# Altium project Science.PrjPcb
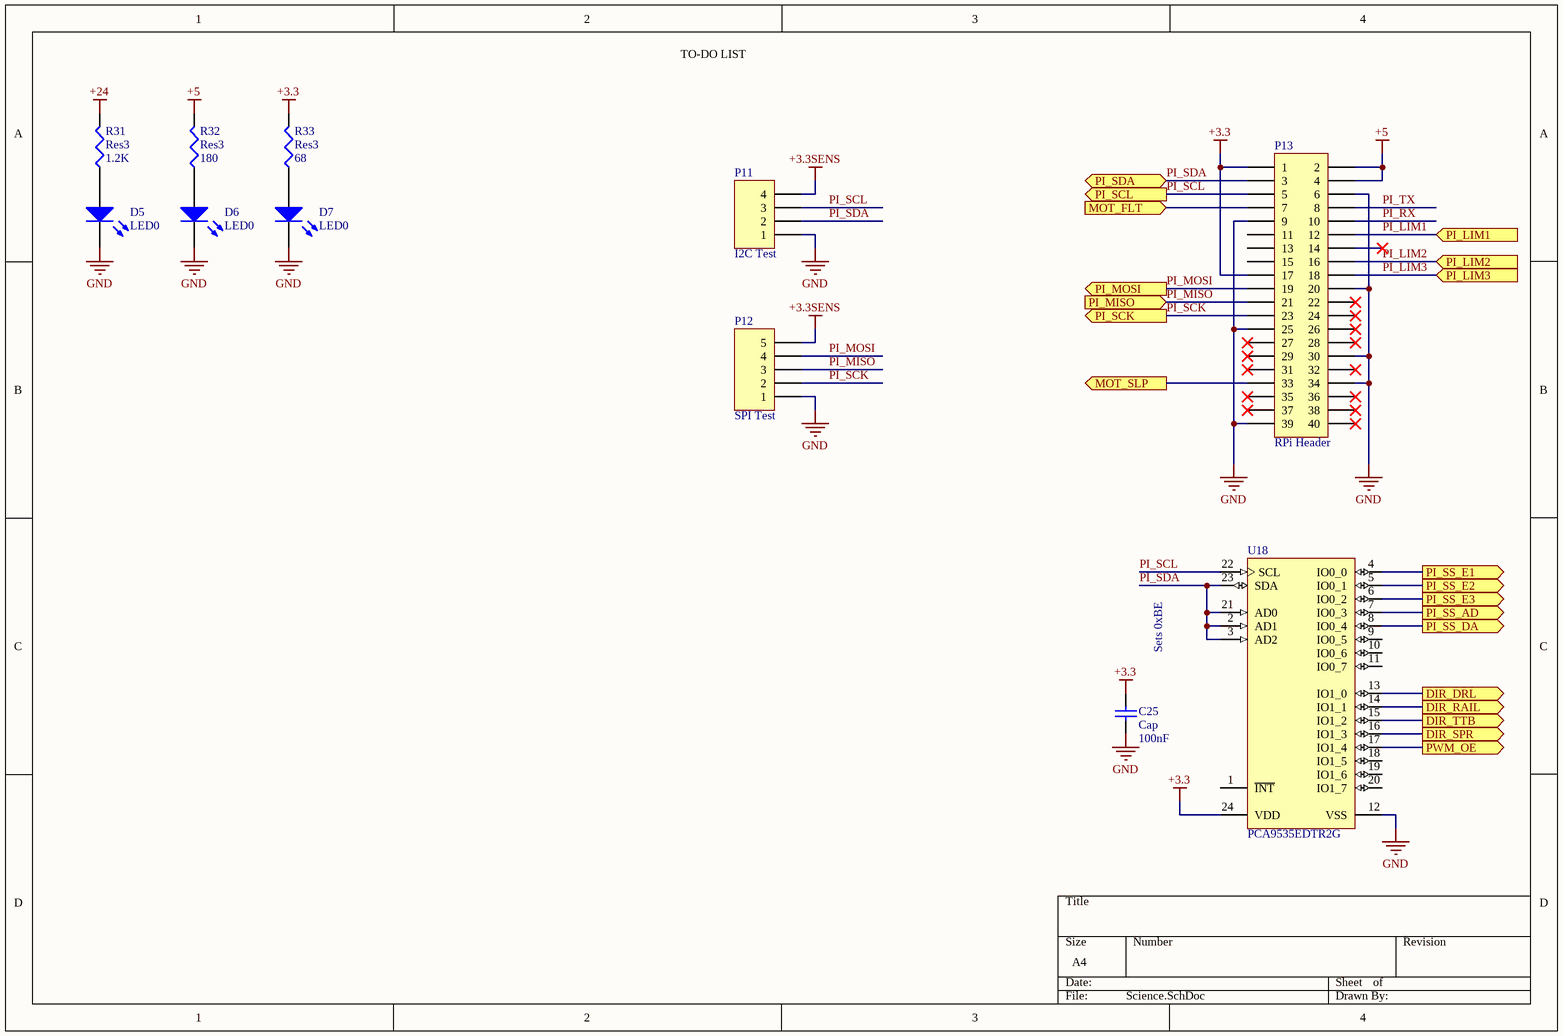
[diagram p0: Science.SchDoc]
6 sheets, 133 parts. Net scope: flat (ports and power ports of the same name join across sheets).
Board file: Science.PcbDoc
Sheets:
  Science.SchDoc
  Power.SchDoc
  SensorExt.SchDoc
  SensorInt.SchDoc
  Motors.SchDoc
  Drivers.SchDoc

## Sheet Science.SchDoc
size A4

### Parts
C25  Cap  value 100nF  [C0805]
D5  LED0  [1608[0603]]
D6  LED0  [1608[0603]]
D7  LED0  [1608[0603]]
P11  I2C Test  [HDR1X4]
P12  SPI Test  [HDR1X5]
P13  RPi Header  [RPi-3B+]
R31  Res3  value 1.2K  [C0805]
R32  Res3  value 180  [C0805]
R33  Res3  value 68  [C0805]
U18  PCA9535EDTR2G  [ONSC-TSSOP-24-948H_V]

### Ports
DIR_DRL (out), DIR_RAIL (out), DIR_SPR (out), DIR_TTB (out), MOT_FLT (in), MOT_SLP (out), PI_LIM1 (in), PI_LIM2 (in), PI_LIM3 (in), PI_MISO (in), PI_MOSI (out), PI_SCK (out), PI_SCL (out), PI_SDA (bidir), PI_SS_AD (out), PI_SS_DA (out), PI_SS_E1 (out), PI_SS_E2 (out), PI_SS_E3 (out), PWM_OE (out)

### Nets
+3.3: C25.2 P13.1 P13.17 R33.2 U18.24(VDD)
+3.3SENS: P11.4 P12.5
+5: P13.2 P13.4 R32.2
+24: R31.2
GND: C25.1 D5.2(K) D6.2(K) D7.2(K) P11.1 P12.1 P13.6 P13.9 P13.20 P13.25 P13.30 P13.34 P13.39 U18.12(VSS)
FAULT: P13.7 ; port MOT_FLT
PI_LIM1: P13.12 ; port PI_LIM1
PI_LIM2: P13.16 ; port PI_LIM2
PI_LIM3: P13.18 ; port PI_LIM3
PI_MISO: P12.3 P13.21 ; port PI_MISO
PI_MOSI: P12.4 P13.19 ; port PI_MOSI
PI_RX: P13.10
PI_SCK: P12.2 P13.23 ; port PI_SCK
PI_SCL: P11.3 P13.5 U18.22(SCL) ; port PI_SCL
PI_SDA: P11.2 P13.3 U18.2(AD1) U18.3(AD2) U18.21(AD0) U18.23(SDA) ; port PI_SDA
PI_TX: P13.8
SLEEP: P13.33 ; port MOT_SLP
NetD5_1: D5.1(A) R31.1
NetD6_1: D6.1(A) R32.1
NetD7_1: D7.1(A) R33.1
NetR1_2: U18.17(IO1_4) ; port PWM_OE
NetU6_11: U18.8(IO0_4) ; port PI_SS_DA
NetU7_2: U18.13(IO1_0) ; port DIR_DRL
NetU8_2: U18.14(IO1_1) ; port DIR_RAIL
NetU9_2: U18.15(IO1_2) ; port DIR_TTB
NetU10_2: U18.16(IO1_3) ; port DIR_SPR
NetU18_4: U18.4(IO0_0) ; port PI_SS_E1
NetU18_5: U18.5(IO0_1) ; port PI_SS_E2
NetU18_6: U18.6(IO0_2) ; port PI_SS_E3
NetU18_7: U18.7(IO0_3) ; port PI_SS_AD

Not connected (* = marked no-connect by the designer): P13 11 13 14* 15 22* 24* 26* 27* 28* 29* 31* 32* 35* 36* 37* 38* 40*; U18 1(~{INT}) 9(IO0_5) 10(IO0_6) 11(IO0_7) 18(IO1_5) 19(IO1_6) 20(IO1_7)

### Notes on the sheet
- TO-DO LIST
- Sets 0xBE

### Library data of the parts
C25 = Cap: Capacitor; Published: 8-Jun-2000; LatestRevisionDate: 17-Jul-2002; LatestRevisionNote: Re-released for DXP Platform.; PackageReference: RAD-0.3; Publisher: Altium Limited; PackageDescription: Radial Cap, Thru-Hole; 2 Leads; 0.3 in Pin Spacing
D5-D7 = LED0: Typical INFRARED GaAs LED; Published: 8-Jun-2000; LatestRevisionDate: 08-Jul-2005; LatestRevisionNote: Mech Layer 1 removed.; PackageReference: LED-0; Publisher: Altium Limited; PackageDescription: LED; 2 Leads
P11 = Header 4: Header, 4-Pin; LatestRevisionDate: 17-Jul-2002; LatestRevisionNote: Re-released for DXP Platform.; Publisher: Altium Limited
P12 = Header 5: Header, 5-Pin; LatestRevisionDate: 17-Jul-2002; LatestRevisionNote: Re-released for DXP Platform.; Publisher: Altium Limited
P13 = Header 20X2: Header, 20-Pin, Dual row; LatestRevisionDate: 17-Jul-2002; LatestRevisionNote: Re-released for DXP Platform.; Publisher: Altium Limited
R31-R33 = Res3: Resistor; Published: 8-Jun-2000; LatestRevisionDate: 29-May-2009; LatestRevisionNote: IPC-7351 Footprint Added.; PackageReference: J1-0603; Publisher: Altium Limited; PackageDescription: Chip Resistor
U18 = CMP-1316-00043-1: 16-Bit Low-Power I/O Expander for I2C Bus with Interrupt, 1.65 to 5.5 V, -55 to 125 degC, 24-Pin TSSOP, Pb-Free, Tape and Reel; Manufacturer: On Semiconductor; VCC Min (V): 1.65; LED Blink/PWM: No; I/O: 16; VCC Max (V): 5.5; RoHS: TRUE; DatasheetVersion: Rev. 5; ComponentLink3Description: Package Specification; PackageVersion: Rev. B, 06/2012; ComponentLink3URL: http://www.onsemi.cn/pub_link/Collateral/948H-01.PDF; Mounting Technology: Surface Mount; ComponentLink2URL: http://www.onsemi.com/pub_link/Collateral/PCA9535E-D.PDF; PartNumber: PCA9535EDTR2G; ComponentLink1Description: Manufacturer URL; ComponentLink1URL: http://www.onsemi.com/; PackageReference: TSSOP-24-948H; ComponentLink2Description: Datasheet; PackageDescription: 24-Pin Small Outline Package, Body 7.8 x 4.4 mm, Pitch 0.65 mm; Packing: Tape and Reel

## Sheet Power.SchDoc
size A4
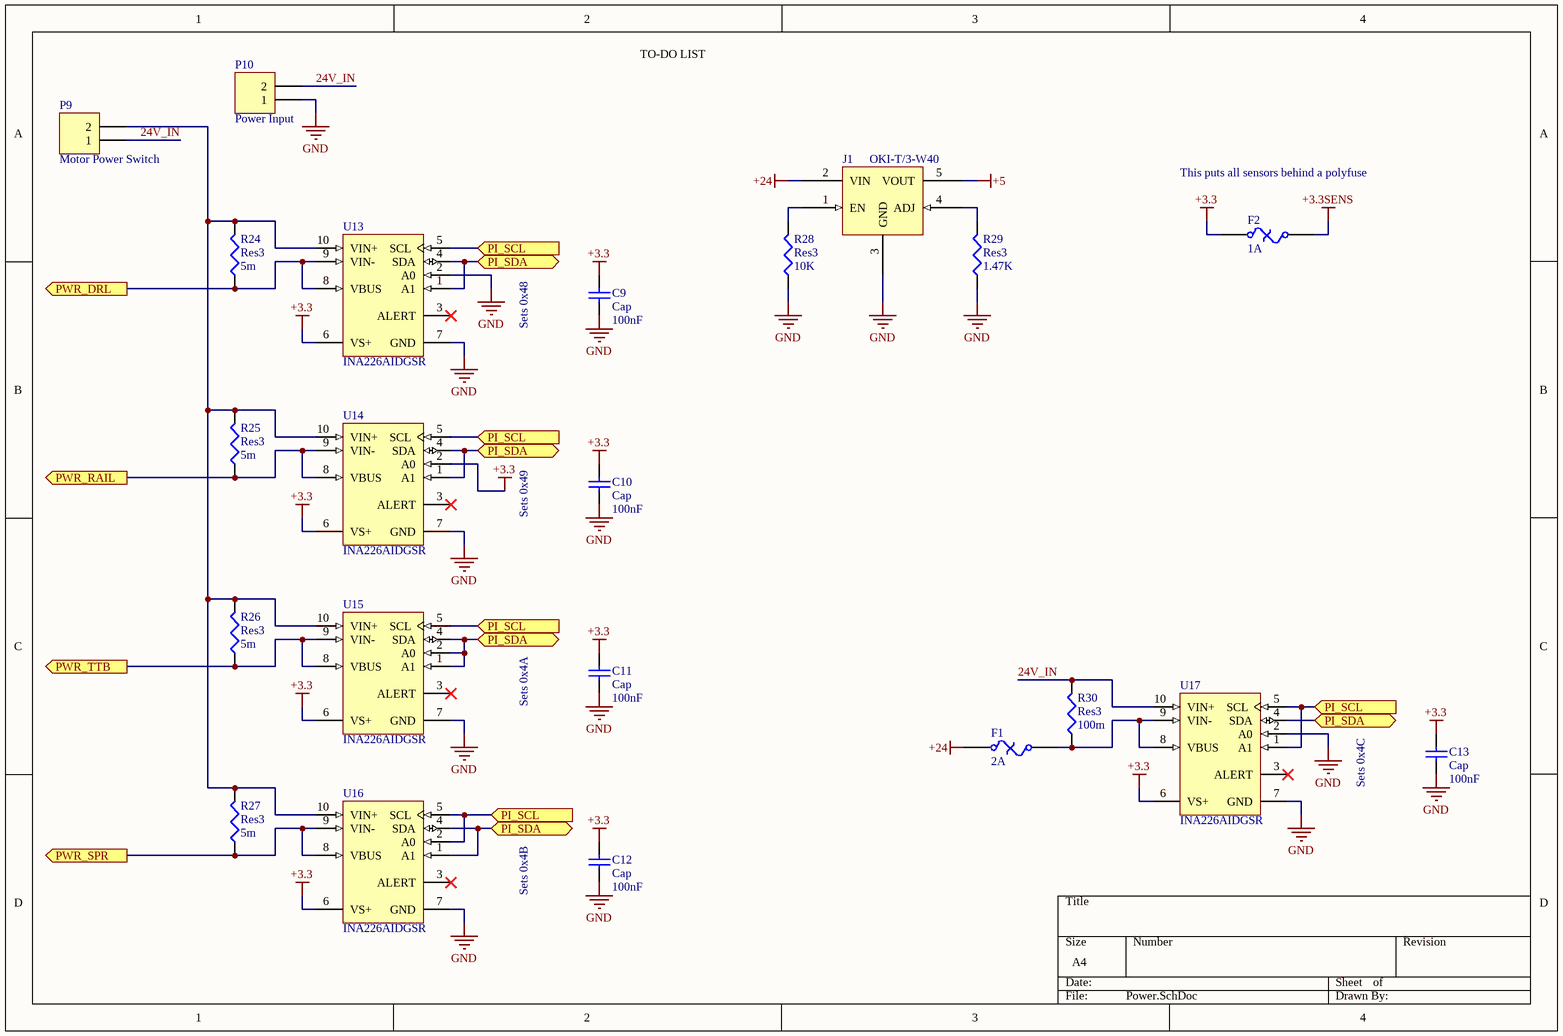
[diagram p1: Power.SchDoc]

### Parts
C9  Cap  value 100nF  [C0805]
C10  Cap  value 100nF  [C0805]
C11  Cap  value 100nF  [C0805]
C12  Cap  value 100nF  [C0805]
C13  Cap  value 100nF  [C0805]
F1  2A  [2920]
F2  1A  [2920]
J1  OKI-T/3-W40  [OKI-T/3-W40]
P9  Motor Power Switch  [SuperSabre-2pos]
P10  Power Input  [SuperSabre-2pos]
R24  Res3  value 5m  [FCSL110]
R25  Res3  value 5m  [FCSL110]
R26  Res3  value 5m  [FCSL110]
R27  Res3  value 5m  [FCSL110]
R28  Res3  value 10K  [C0805]
R29  Res3  value 1.47K  [C0805]
R30  Res3  value 100m  [RW5S0]
U13  INA226AIDGSR  [DGS0010A_L]
U14  INA226AIDGSR  [DGS0010A_L]
U15  INA226AIDGSR  [DGS0010A_L]
U16  INA226AIDGSR  [DGS0010A_L]
U17  INA226AIDGSR  [DGS0010A_L]

### Ports
PI_SCL (in), PI_SDA (bidir), PWR_DRL (out), PWR_RAIL (out), PWR_SPR (out), PWR_TTB (out)

### Nets
+3.3: C9.2 C10.2 C11.2 C12.2 C13.2 F2.1 U13.6(VS+) U14.2(A0) U14.6(VS+) U15.6(VS+) U16.6(VS+) U17.6(VS+)
+3.3SENS: F2.2
+5: J1.5(VOUT)
+24: F1.1 J1.2(VIN)
GND: C9.1 C10.1 C11.1 C12.1 C13.1 J1.3(GND) P10.1 R28.1 R29.1 U13.2(A0) U13.7(GND) U14.7(GND) U15.7(GND) U16.7(GND) U17.2(A0) U17.7(GND)
24V_IN: P9.1 P10.2 R30.2 U17.10(VIN+)
PI_SCL: U13.5(SCL) U14.5(SCL) U15.5(SCL) U16.2(A0) U16.5(SCL) U17.1(A1) U17.5(SCL) ; port PI_SCL
PI_SDA: U13.1(A1) U13.4(SDA) U14.1(A1) U14.4(SDA) U15.1(A1) U15.2(A0) U15.4(SDA) U16.1(A1) U16.4(SDA) U17.4(SDA) ; port PI_SDA
NetF1_2: F1.2 R30.1 U17.8(VBUS) U17.9(VIN-)
NetJ1_1: J1.1(EN) R28.2
NetJ1_4: J1.4(ADJ) R29.2
NetP9_2: P9.2 R24.2 R25.2 R26.2 R27.2 U13.10(VIN+) U14.10(VIN+) U15.10(VIN+) U16.10(VIN+)
NetR24_1: R24.1 U13.8(VBUS) U13.9(VIN-) ; port PWR_DRL
NetR25_1: R25.1 U14.8(VBUS) U14.9(VIN-) ; port PWR_RAIL
NetR26_1: R26.1 U15.8(VBUS) U15.9(VIN-) ; port PWR_TTB
NetR27_1: R27.1 U16.8(VBUS) U16.9(VIN-) ; port PWR_SPR

Not connected (* = marked no-connect by the designer): U13 3(ALERT)*; U14 3(ALERT)*; U15 3(ALERT)*; U16 3(ALERT)*; U17 3(ALERT)*

### Notes on the sheet
- (near J1) TO-DO LIST
- This puts all sensors behind a polyfuse
- Sets 0x48
- Sets 0x49
- Sets 0x4A
- Sets 0x4C
- Sets 0x4B

### Library data of the parts
C9-C13 = Cap: Capacitor; Published: 8-Jun-2000; LatestRevisionDate: 17-Jul-2002; LatestRevisionNote: Re-released for DXP Platform.; PackageReference: RAD-0.3; Publisher: Altium Limited; PackageDescription: Radial Cap, Thru-Hole; 2 Leads; 0.3 in Pin Spacing
F1 F2 = Fuse Thermal: Thermal Fuse; Published: 24-Mar-1999; LatestRevisionDate: 17-Jul-2002; LatestRevisionNote: Re-released for DXP Platform.; PackageReference: PIN-W2/E2.8; Publisher: Altium Limited; PackageDescription: Thru-Hole; 2 Leads
J1 = OKI-T/3-W40: Adjustable Output 3-Amp DOSA-SMT DC/DC Converters; ComponentLink1Description: Datasheet; ComponentLink1URL: https://power.murata.com/data/power/oki-t3-w40.pdf
P9 P10 = Header 2: Header, 2-Pin; LatestRevisionDate: 17-Jul-2002; LatestRevisionNote: Re-released for DXP Platform.; Publisher: Altium Limited
R24-R30 = Res3: Resistor; Published: 8-Jun-2000; LatestRevisionDate: 29-May-2009; LatestRevisionNote: IPC-7351 Footprint Added.; PackageReference: J1-0603; Publisher: Altium Limited; PackageDescription: Chip Resistor
U13-U17 = CMP-0704-00058-2: High-Side Measurement, Bi-Directional Current / Power Monitor with I2C Interface, 2.7 to 5.5 V, -40 to 125 degC, 10-pin SOP (DGS10), Green (RoHS & no Sb/Br); Vs(Max)(V): 5.5; CMRR(Min)(dB): 126; Rating: Catalog; Input Offset (+/-)(Max)(uV): 10; Small-Signal Bandwidth(Typ)(MHz): 0.007; Input Offset Drift (+/-)(Max)(uV/Degrees Celsius): 0.1; Common Mode Range(Max)(V): 36; Gain(V/V): 1; SubFamily: Current Shunt Monitor; Quiescent Current (+/-)(Typ)(mA): 0.33; Vs(Min)(V): 2.7; Common Mode Range(Min)(V): 0; ComponentLink2URL: http://www.ti.com/general/docs/lit/getliterature.tsp?genericPartNumber=INA226&fileType=pdf; ComponentLink1URL: http://www.ti.com/; PartNumber: INA226AIDGSR; Mounting Technology: Surface Mount; PackageDescription: 10-Pin Plastic Small Outline, Body 3 x 3 mm, Pitch 0.5 mm; ComponentLink3Description: Package Specification; Code_JEDEC: MO-153; Eco-Plan: Green (RoHS & no Sb/Br); PackageReference: DGS0010A; ComponentLink2Description: Datasheet; ComponentLink3URL: http://www.ti.com/lit/ml/mpds035b/mpds035b.pdf; ComponentLink1Description: Manufacturer URL; DatasheetVersion: SBOS547; PackageVersion: 4073272/C, 02/2004

## Sheet SensorExt.SchDoc
size A4
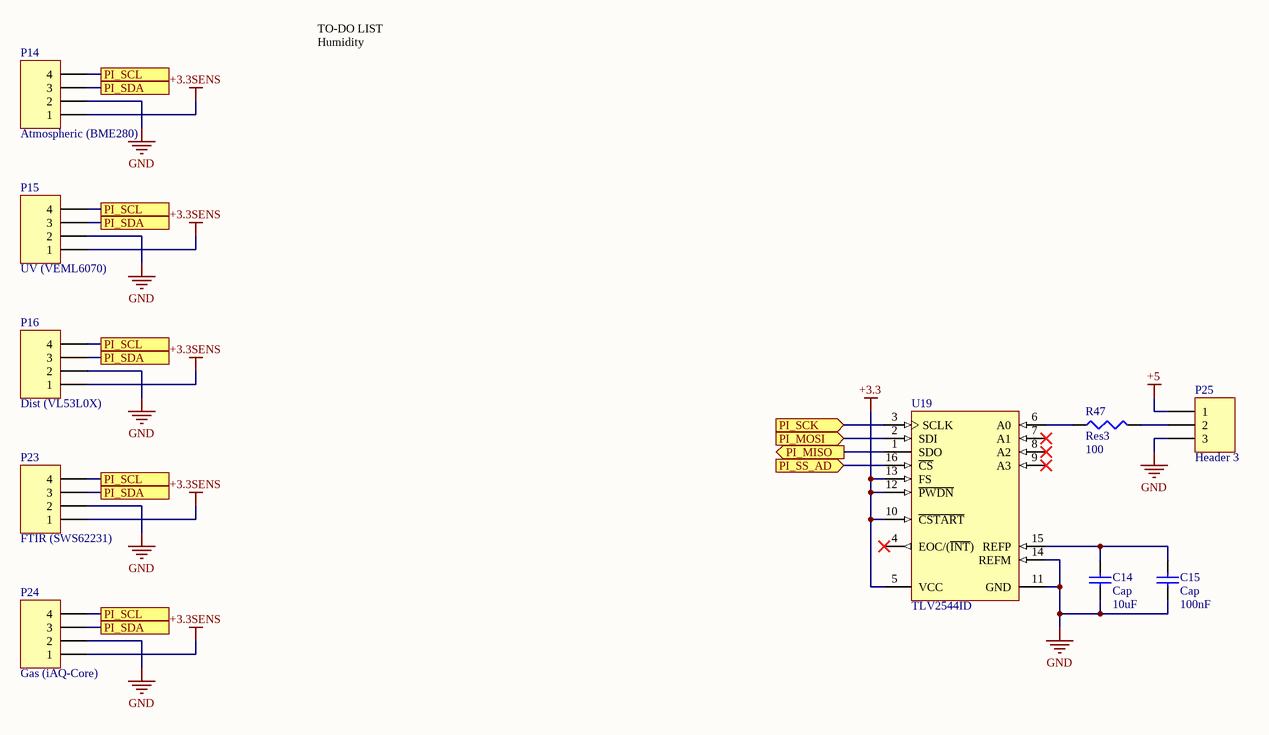
[diagram p2: SensorExt.SchDoc]

### Parts
C14  Cap  value 10uF  [C0805]
C15  Cap  value 100nF  [C0805]
P14  Atmospheric (BME280)  [22-23-20x1-4pos]
P15  UV (VEML6070)  [22-23-20x1-4pos]
P16  Dist (VL53L0X)  [22-23-20x1-4pos]
P23  FTIR (SWS62231)  [22-23-20x1-4pos]
P24  Gas (iAQ-Core)  [22-23-20x1-4pos]
P25  Header 3  [22-23-20x1-3pos]
R47  Res3  value 100  [C0805]
U19  TLV2544ID  [TI-D16_M]

### Ports
PI_MISO (out), PI_MOSI (in), PI_SCK (in), PI_SCL, PI_SDA, PI_SS_AD (in)

### Nets
+3.3: U19.5(VCC) U19.10(~{CSTART}) U19.12(~{PWDN}) U19.13(FS)
+3.3SENS: P14.1 P15.1 P16.1 P23.1 P24.1
+5: P25.1
GND: C14.1 C15.1 P14.2 P15.2 P16.2 P23.2 P24.2 P25.3 U19.11(GND) U19.14(REFM)
PI_MISO: U19.1(SDO) ; port PI_MISO
PI_MOSI: U19.2(SDI) ; port PI_MOSI
PI_SCK: U19.3(SCLK) ; port PI_SCK
PI_SCL: P14.4 P15.4 P16.4 P23.4 P24.4 ; port PI_SCL
PI_SDA: P14.3 P15.3 P16.3 P23.3 P24.3 ; port PI_SDA
NetC14_2: C14.2 C15.2 U19.15(REFP)
NetP25_2: P25.2 R47.2
NetR47_1: R47.1 U19.6(A0)
NetU18_7: U19.16(~{CS}) ; port PI_SS_AD

Not connected (* = marked no-connect by the designer): U19 4(EOC/(~{INT}))* 7(A1)* 8(A2)* 9(A3)*

### Notes on the sheet
- TO-DO LIST
  Humidity

### Library data of the parts
C14 C15 = Cap: Capacitor; Published: 8-Jun-2000; LatestRevisionDate: 17-Jul-2002; LatestRevisionNote: Re-released for DXP Platform.; PackageReference: RAD-0.3; Publisher: Altium Limited; PackageDescription: Radial Cap, Thru-Hole; 2 Leads; 0.3 in Pin Spacing
P14-P16 P23 P24 = Header 4: Header, 4-Pin; LatestRevisionDate: 17-Jul-2002; LatestRevisionNote: Re-released for DXP Platform.; Publisher: Altium Limited
P25 = Header 3: Header, 3-Pin; LatestRevisionDate: 17-Jul-2002; LatestRevisionNote: Re-released for DXP Platform.; Publisher: Altium Limited
R47 = Res3: Resistor; Published: 8-Jun-2000; LatestRevisionDate: 29-May-2009; LatestRevisionNote: IPC-7351 Footprint Added.; PackageReference: J1-0603; Publisher: Altium Limited; PackageDescription: Chip Resistor
U19 = CMP-0003-01025-2: 12-Bit 200 kSPS ADC Serial Out, Auto Power Down (Software and Hardware), Low Power with 8 x FIFO with 4 Channel, -40 to 85 degC, 16-pin SOIC (D16), Green (RoHS & no Sb/Br); Manufacturer: Texas Instruments; SFDR(dB): 84; Architecture: SAR; Digital Supply(Min)(V): 2.7; Interface: Serial SPI; ENOB(Bits): 11.6; # Input Channels: 4; Sample Rate (max)(SPS): 200k; Analog Voltage AV/DD(Max)(V): 5.5; SubFamily: Precision ADC (<=10MSPS); INL(Max)(+/-LSB): 1; SINAD(dB): 70; Resolution(Bits): 12; DatasheetVersion: SLAS198E; Analog Voltage AV/DD(Min)(V): 2.7; PackageDescription: 16-Pin Plastic Small Outline, Body 9.9 x 3.9 mm, Pitch 1.27 mm; PackageVersion: 4040047-6/M, 06/2011; PartNumber: TLV2544ID; Eco-Plan: Green (RoHS & no Sb/Br); ComponentLink2Description: Datasheet; PackageReference: D16; ComponentLink3Description: Package Specification; Code_JEDEC: MS-012; ComponentLink3URL: http://www.ti.com/litv/pdf/mpds178g; Digital Supply(Max)(V): 5.5; ComponentLink1Description: Manufacturer URL; Mounting Technology: Surface Mount; ComponentLink2URL: http://www.ti.com/general/docs/lit/getliterature.tsp?genericPartNumber=TLV2544&fileType=pdf; ComponentLink1URL: http://www.ti.com/

## Sheet SensorInt.SchDoc
size A4
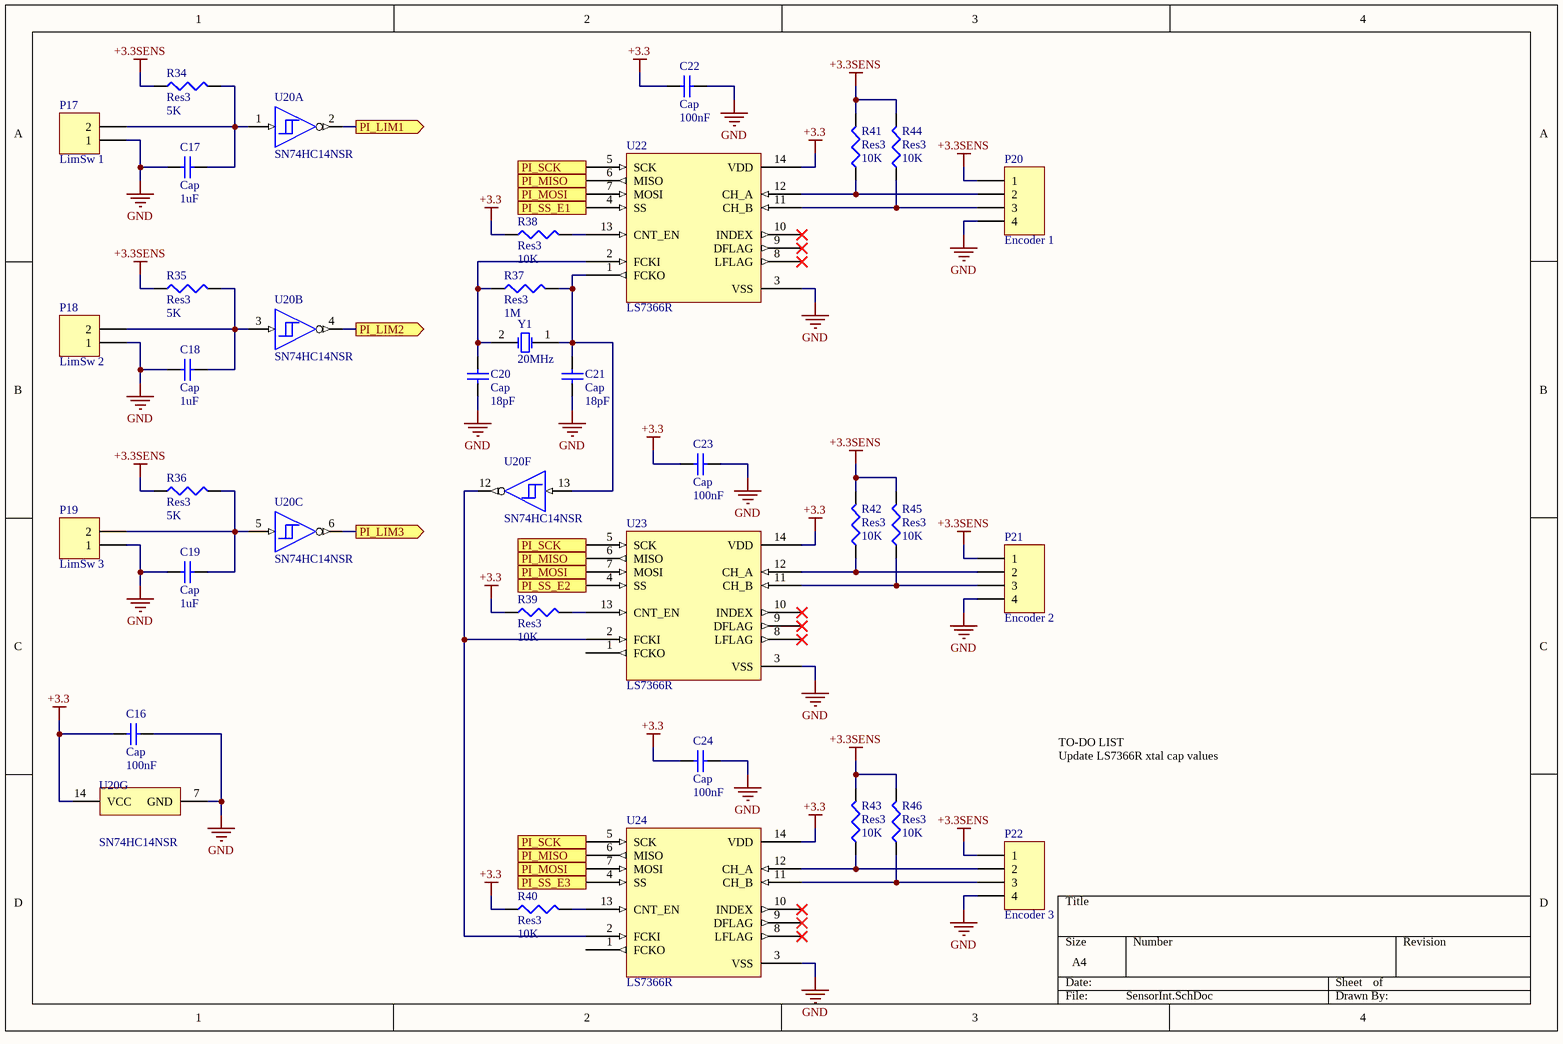
[diagram p3: SensorInt.SchDoc]

### Parts
C16  Cap  value 100nF  [C0805]
C17  Cap  value 1uF  [C0805]
C18  Cap  value 1uF  [C0805]
C19  Cap  value 1uF  [C0805]
C20  Cap  value 18pF  [C0805]
C21  Cap  value 18pF  [C0805]
C22  Cap  value 100nF  [C0805]
C23  Cap  value 100nF  [C0805]
C24  Cap  value 100nF  [C0805]
P17  LimSw 1  [22-23-20x1-2pos]
P18  LimSw 2  [22-23-20x1-2pos]
P19  LimSw 3  [22-23-20x1-2pos]
P20  Encoder 1  [22-23-20x1-4pos]
P21  Encoder 2  [22-23-20x1-4pos]
P22  Encoder 3  [22-23-20x1-4pos]
R34  Res3  value 5K  [C0805]
R35  Res3  value 5K  [C0805]
R36  Res3  value 5K  [C0805]
R37  Res3  value 1M  [C0805]
R38  Res3  value 10K  [C0805]
R39  Res3  value 10K  [C0805]
R40  Res3  value 10K  [C0805]
R41  Res3  value 10K  [C0805]
R42  Res3  value 10K  [C0805]
R43  Res3  value 10K  [C0805]
R44  Res3  value 10K  [C0805]
R45  Res3  value 10K  [C0805]
R46  Res3  value 10K  [C0805]
U20  SN74HC14NSR  [NS0014A_M]  (parts A,B,C,F,G of 7)
U22  LS7366R  [SOIC14N]
U23  LS7366R  [SOIC14N]
U24  LS7366R  [SOIC14N]
Y1  20MHz  [ABM3]

### Ports
PI_LIM1 (out), PI_LIM2 (out), PI_LIM3 (out), PI_MISO (out), PI_MOSI (in), PI_SCK (in), PI_SS_E1 (in), PI_SS_E2 (in), PI_SS_E3 (in)

### Nets
+3.3: C16.1 C22.1 C23.1 C24.1 R38.1 R39.1 R40.1 U20.14(VCC) U22.14(VDD) U23.14(VDD) U24.14(VDD)
+3.3SENS: P20.1 P21.1 P22.1 R34.1 R35.1 R36.1 R41.2 R42.2 R43.2 R44.2 R45.2 R46.2
GND: C16.2 C17.1 C18.1 C19.1 C20.1 C21.1 C22.2 C23.2 C24.2 P17.1 P18.1 P19.1 P20.4 P21.4 P22.4 U20.7(GND) U22.3(VSS) U23.3(VSS) U24.3(VSS)
PI_LIM1: U20.2(~{1Y}) ; port PI_LIM1
PI_LIM2: U20.4(~{2Y}) ; port PI_LIM2
PI_LIM3: U20.6(~{3Y}) ; port PI_LIM3
PI_MISO: U22.6(MISO) U23.6(MISO) U24.6(MISO) ; port PI_MISO
PI_MOSI: U22.7(MOSI) U23.7(MOSI) U24.7(MOSI) ; port PI_MOSI
PI_SCK: U22.5(SCK) U23.5(SCK) U24.5(SCK) ; port PI_SCK
NetC17_2: C17.2 P17.2 R34.2 U20.1(1A)
NetC18_2: C18.2 P18.2 R35.2 U20.3(2A)
NetC19_2: C19.2 P19.2 R36.2 U20.5(3A)
NetC20_2: C20.2 R37.1 U22.2(FCKI) Y1.2(OSC2)
NetC21_2: C21.2 R37.2 U20.13(6A) U22.1(FCKO) Y1.1(OSC1)
NetP20_2: P20.2 R41.1 U22.12(CH_A)
NetP20_3: P20.3 R44.1 U22.11(CH_B)
NetP21_2: P21.2 R42.1 U23.12(CH_A)
NetP21_3: P21.3 R45.1 U23.11(CH_B)
NetP22_2: P22.2 R43.1 U24.12(CH_A)
NetP22_3: P22.3 R46.1 U24.11(CH_B)
NetR38_2: R38.2 U22.13(CNT_EN)
NetR39_2: R39.2 U23.13(CNT_EN)
NetR40_2: R40.2 U24.13(CNT_EN)
NetU18_4: U22.4(SS) ; port PI_SS_E1
NetU18_5: U23.4(SS) ; port PI_SS_E2
NetU18_6: U24.4(SS) ; port PI_SS_E3
NetU20_12: U20.12(~{6Y}) U23.2(FCKI) U24.2(FCKI)

Not connected (* = marked no-connect by the designer): U22 8(LFLAG)* 9(DFLAG)* 10(INDEX)*; U23 1(FCKO) 8(LFLAG)* 9(DFLAG)* 10(INDEX)*; U24 1(FCKO) 8(LFLAG)* 9(DFLAG)* 10(INDEX)*

### Notes on the sheet
- TO-DO LIST
  Update LS7366R xtal cap values

### Library data of the parts
C16-C24 = Cap: Capacitor; Published: 8-Jun-2000; LatestRevisionDate: 17-Jul-2002; LatestRevisionNote: Re-released for DXP Platform.; PackageReference: RAD-0.3; Publisher: Altium Limited; PackageDescription: Radial Cap, Thru-Hole; 2 Leads; 0.3 in Pin Spacing
P17-P19 = Header 2: Header, 2-Pin; LatestRevisionDate: 17-Jul-2002; LatestRevisionNote: Re-released for DXP Platform.; Publisher: Altium Limited
P20-P22 = Header 4: Header, 4-Pin; LatestRevisionDate: 17-Jul-2002; LatestRevisionNote: Re-released for DXP Platform.; Publisher: Altium Limited
R34-R46 = Res3: Resistor; Published: 8-Jun-2000; LatestRevisionDate: 29-May-2009; LatestRevisionNote: IPC-7351 Footprint Added.; PackageReference: J1-0603; Publisher: Altium Limited; PackageDescription: Chip Resistor
U20 = CMP-1615-00079-5: Hex Schmitt-Trigger Inverters, NS0014A, LARGE T&R; Manufacturer: Texas Instruments; VCC(Min)(V): 2; F @ Nom Voltage(Max)(Mhz): 20; Bits(#): 6; Output Drive (IOL/IOH)(Max)(mA): -4/4; ICC @ Nom Voltage(Max)(mA): 0.02; Rating: Catalog; Technology Family: HC; Input Type: CMOS; tpd @ Nom Voltage(Max)(ns): 31; Voltage(Nom)(V): 5; Schmitt Trigger: Yes; Operating Temperature Range(C): -40 to 85; VCC(Max)(V): 6; Generic Part Number: SN74HC14; PackageReference: NS0014A; DatasheetVersion: SCLS085G; Output Type: CMOS
U22-U24 = LS7366R: 32-BIT QUADRATURE COUNTER WITH SERIAL INTERFACE; ComponentLink1Description: Datasheet; ComponentLink1URL: https://lsicsi.com/pdfs/Data_Sheets/LS7366R.pdf
Y1 = XTAL: Crystal Oscillator; Published: 8-Jun-2000; LatestRevisionDate: 17-Jul-2002; LatestRevisionNote: Re-released for DXP Platform.; PackageReference: R38; Publisher: Altium Limited; PackageDescription: Crystal, Thru-Hole; 2 Leads; Body 3.1 x 8.2 mm (Dia.xH)

## Sheet Motors.SchDoc
size A4
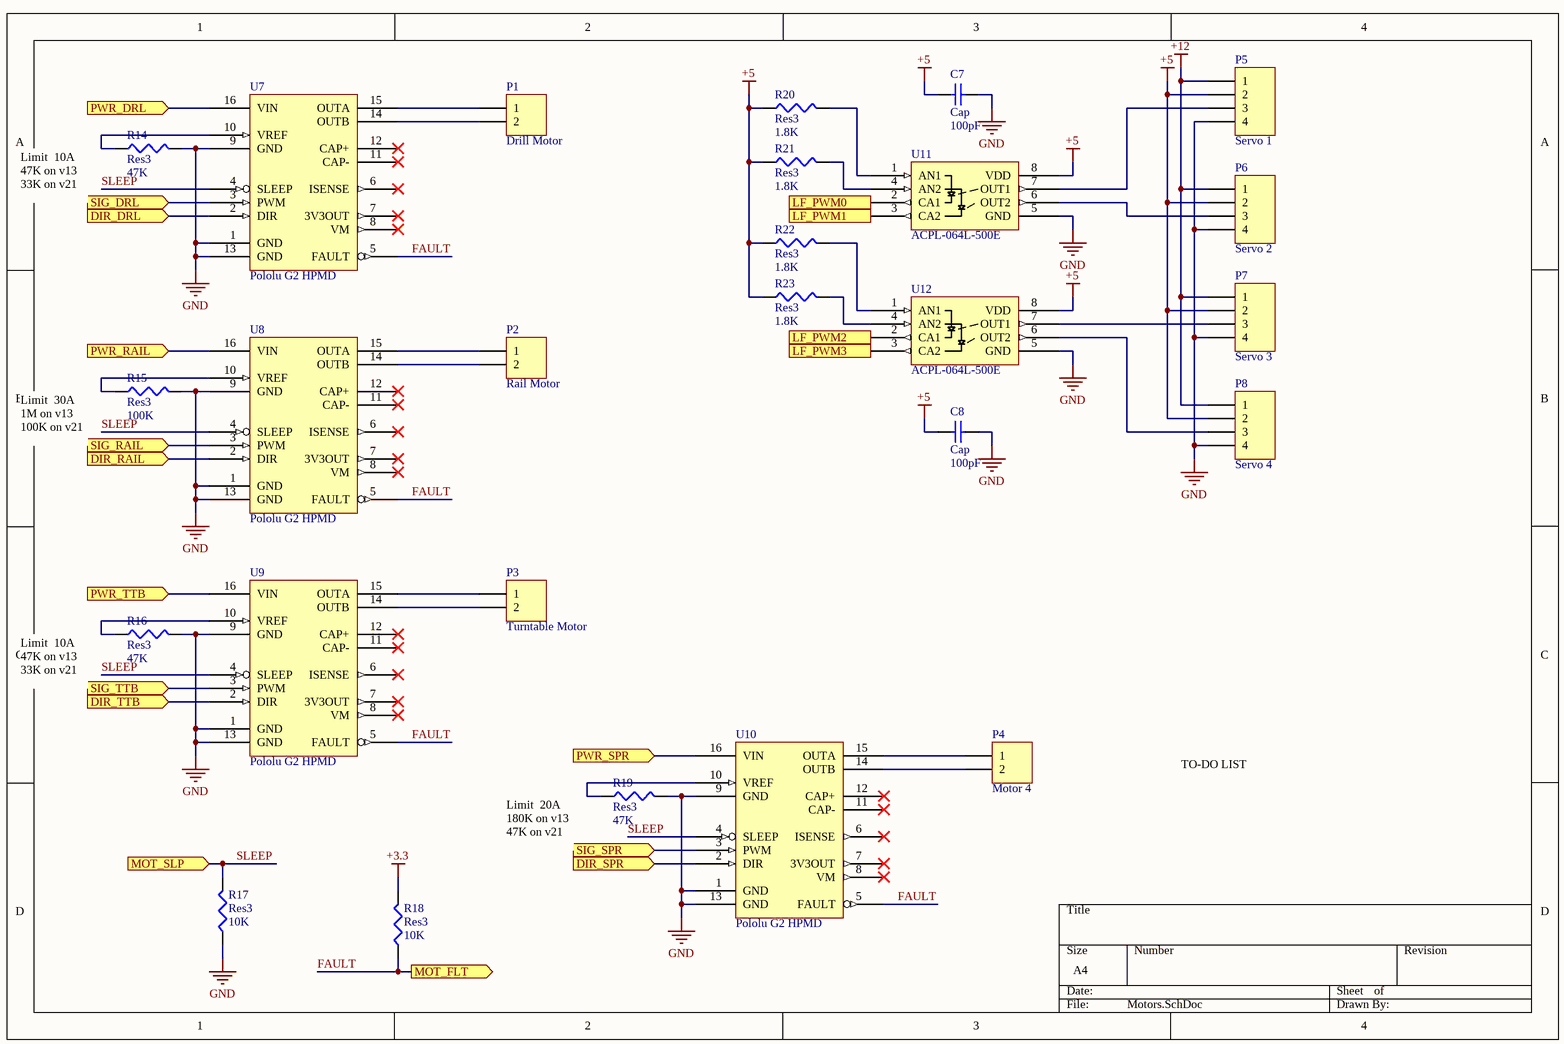
[diagram p4: Motors.SchDoc]

### Parts
C7  Cap  value 100pF  [C0805]
C8  Cap  value 100pF  [C0805]
P1  Drill Motor  [Sabre-2pos]
P2  Rail Motor  [Sabre-2pos]
P3  Turntable Motor  [Sabre-2pos]
P4  Motor 4  [Sabre-2pos]
P5  Servo 1  [22-23-20x1-4pos]
P6  Servo 2  [22-23-20x1-4pos]
P7  Servo 3  [22-23-20x1-4pos]
P8  Servo 4  [22-23-20x1-4pos]
R14  Res3  value 47K  [C0805]
R15  Res3  value 100K  [C0805]
R16  Res3  value 47K  [C0805]
R17  Res3  value 10K  [C0805]
R18  Res3  value 10K  [C0805]
R19  Res3  value 47K  [C0805]
R20  Res3  value 1.8K  [C0805]
R21  Res3  value 1.8K  [C0805]
R22  Res3  value 1.8K  [C0805]
R23  Res3  value 1.8K  [C0805]
U7  Pololu G2 HPMD  [Pololu-HPMDG2-SCIENCE]
U8  Pololu G2 HPMD  [Pololu-HPMDG2-SCIENCE]
U9  Pololu G2 HPMD  [Pololu-HPMDG2-SCIENCE]
U10  Pololu G2 HPMD  [Pololu-HPMDG2-SCIENCE]
U11  ACPL-064L-500E  [ACPL-064L]
U12  ACPL-064L-500E  [ACPL-064L]

### Ports
DIR_DRL (in), DIR_RAIL (in), DIR_SPR (in), DIR_TTB (in), LF_PWM0 (out), LF_PWM1 (out), LF_PWM2 (out), LF_PWM3 (out), MOT_FLT (out), MOT_SLP (in), PWR_DRL (in), PWR_RAIL (in), PWR_SPR (in), PWR_TTB (in), SIG_DRL (in), SIG_RAIL (in), SIG_SPR (in), SIG_TTB (in)

### Nets
+3.3: R18.2
+5: C7.2 C8.2 P5.2 P6.2 P7.2 P8.2 R20.1 R21.1 R22.1 R23.1 U11.8(VDD) U12.8(VDD)
+12: P5.1 P6.1 P7.1 P8.1
GND: C7.1 C8.1 P5.4 P6.4 P7.4 P8.4 R14.2 R15.2 R16.2 R17.1 R19.2 U7.1(GND) U7.9(GND) U7.13(GND) U8.1(GND) U8.9(GND) U8.13(GND) U9.1(GND) U9.9(GND) U9.13(GND) U10.1(GND) U10.9(GND) U10.13(GND) U11.5(GND) U12.5(GND)
FAULT: R18.1 U7.5(FAULT) U8.5(FAULT) U9.5(FAULT) U10.5(FAULT) ; port MOT_FLT
SLEEP: R17.2 U7.4(SLEEP) U8.4(SLEEP) U9.4(SLEEP) U10.4(SLEEP) ; port MOT_SLP
NetP1_1: P1.1 U7.15(OUTA)
NetP1_2: P1.2 U7.14(OUTB)
NetP2_1: P2.1 U8.15(OUTA)
NetP2_2: P2.2 U8.14(OUTB)
NetP3_1: P3.1 U9.15(OUTA)
NetP3_2: P3.2 U9.14(OUTB)
NetP4_1: P4.1 U10.15(OUTA)
NetP4_2: P4.2 U10.14(OUTB)
NetP5_3: P5.3 U11.7(OUT1)
NetP6_3: P6.3 U11.6(OUT2)
NetP7_3: P7.3 U12.7(OUT1)
NetP8_3: P8.3 U12.6(OUT2)
NetR14_1: R14.1 U7.10(VREF)
NetR15_1: R15.1 U8.10(VREF)
NetR16_1: R16.1 U9.10(VREF)
NetR19_1: R19.1 U10.10(VREF)
NetR20_2: R20.2 U11.1(AN1)
NetR21_2: R21.2 U11.4(AN2)
NetR22_2: R22.2 U12.1(AN1)
NetR23_2: R23.2 U12.4(AN2)
NetR24_1: U7.16(VIN) ; port PWR_DRL
NetR25_1: U8.16(VIN) ; port PWR_RAIL
NetR26_1: U9.16(VIN) ; port PWR_TTB
NetR27_1: U10.16(VIN) ; port PWR_SPR
NetU1_6: U11.2(CA1) ; port LF_PWM0
NetU1_7: U11.3(CA2) ; port LF_PWM1
NetU1_8: U12.2(CA1) ; port LF_PWM2
NetU1_9: U12.3(CA2) ; port LF_PWM3
NetU2_6: U7.3(PWM) ; port SIG_DRL
NetU3_6: U8.3(PWM) ; port SIG_RAIL
NetU4_6: U9.3(PWM) ; port SIG_TTB
NetU5_6: U10.3(PWM) ; port SIG_SPR
NetU7_2: U7.2(DIR) ; port DIR_DRL
NetU8_2: U8.2(DIR) ; port DIR_RAIL
NetU9_2: U9.2(DIR) ; port DIR_TTB
NetU10_2: U10.2(DIR) ; port DIR_SPR

Not connected (* = marked no-connect by the designer): U7 6(ISENSE)* 7(3V3OUT)* 8(VM)* 11(CAP-)* 12(CAP+)*; U8 6(ISENSE)* 7(3V3OUT)* 8(VM)* 11(CAP-)* 12(CAP+)*; U9 6(ISENSE)* 7(3V3OUT)* 8(VM)* 11(CAP-)* 12(CAP+)*; U10 6(ISENSE)* 7(3V3OUT)* 8(VM)* 11(CAP-)* 12(CAP+)*

### Notes on the sheet
- (near R14) Limit  10A
  47K on v13
  33K on v21
- (near R15) Limit  30A
  1M on v13
  100K on v21
- (near R16) Limit  10A
  47K on v13
  33K on v21
- (near R19) Limit  20A
  180K on v13
  47K on v21
- TO-DO LIST

### Library data of the parts
C7 C8 = Cap: Capacitor; Published: 8-Jun-2000; LatestRevisionDate: 17-Jul-2002; LatestRevisionNote: Re-released for DXP Platform.; PackageReference: RAD-0.3; Publisher: Altium Limited; PackageDescription: Radial Cap, Thru-Hole; 2 Leads; 0.3 in Pin Spacing
P1-P4 = Header 2: Header, 2-Pin; LatestRevisionDate: 17-Jul-2002; LatestRevisionNote: Re-released for DXP Platform.; Publisher: Altium Limited
P5-P8 = Header 4: Header, 4-Pin; LatestRevisionDate: 17-Jul-2002; LatestRevisionNote: Re-released for DXP Platform.; Publisher: Altium Limited
R14-R23 = Res3: Resistor; Published: 8-Jun-2000; LatestRevisionDate: 29-May-2009; LatestRevisionNote: IPC-7351 Footprint Added.; PackageReference: J1-0603; Publisher: Altium Limited; PackageDescription: Chip Resistor
U7-U10 = Pololu-G2HPMD: Discrete MOSFET H-bridge; ComponentLink1Description: Website; ComponentLink1URL: https://www.pololu.com/product/2995
U11 U12 = ACPL-064L-500E: Low-Power 10-MBd Digital CMOS Optocouplers

## Sheet Drivers.SchDoc
size A4
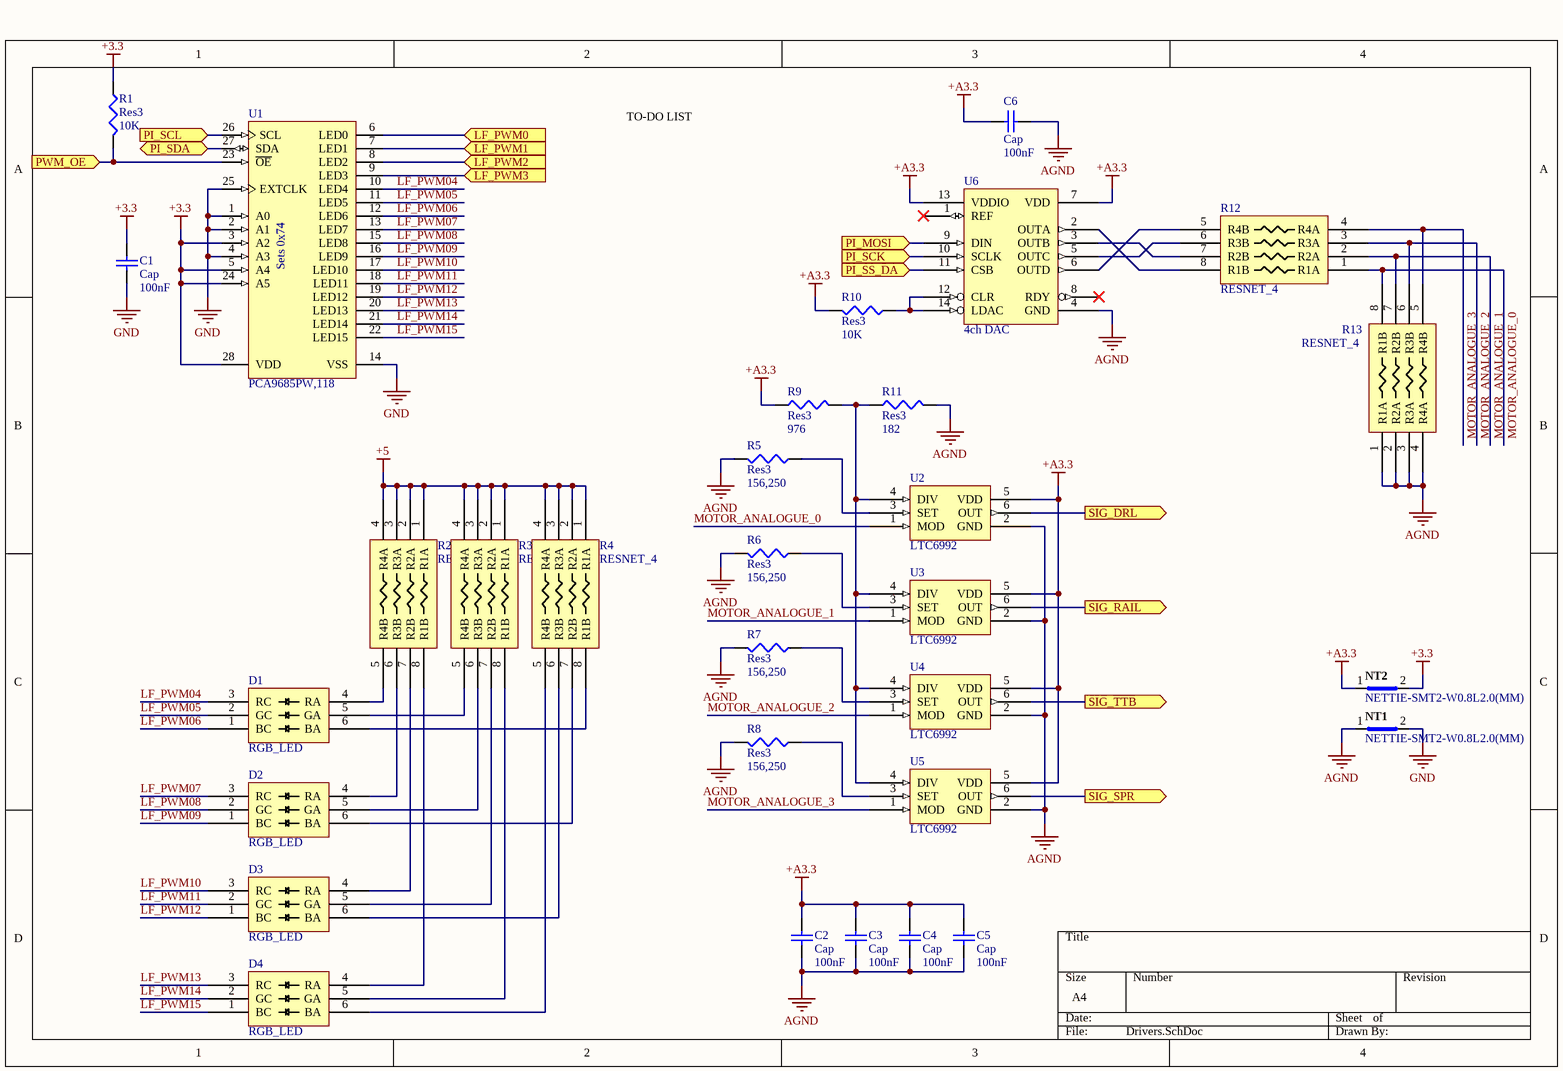
[diagram p5: Drivers.SchDoc]

### Parts
C1  Cap  value 100nF  [C0805]
C2  Cap  value 100nF  [C0805]
C3  Cap  value 100nF  [C0805]
C4  Cap  value 100nF  [C0805]
C5  Cap  value 100nF  [C0805]
C6  Cap  value 100nF  [C0805]
D1  RGB_LED  [SLV6A-FKB]
D2  RGB_LED  [SLV6A-FKB]
D3  RGB_LED  [SLV6A-FKB]
D4  RGB_LED  [SLV6A-FKB]
NT1  NETTIE-SMT2-W0.8L2.0(MM)  [NETTIE-SMT2-W0.8L2.0(MM)]  (net tie, no BOM)
NT2  NETTIE-SMT2-W0.8L2.0(MM)  [NETTIE-SMT2-W0.8L2.0(MM)]  (net tie, no BOM)
R1  Res3  value 10K  [C0805]
R2  RESNET_4  [744C083]
R3  RESNET_4  [744C083]
R4  RESNET_4  [744C083]
R5  Res3  value 156,250  [C0805]
R6  Res3  value 156,250  [C0805]
R7  Res3  value 156,250  [C0805]
R8  Res3  value 156,250  [C0805]
R9  Res3  value 976  [C0805]
R10  Res3  value 10K  [C0805]
R11  Res3  value 182  [C0805]
R12  RESNET_4  [CAY16F4]
R13  RESNET_4  [CAY16F4]
U1  PCA9685PW,118  [SOT361-1_V]
U2  LTC6992  [LTC6992]
U3  LTC6992  [LTC6992]
U4  LTC6992  [LTC6992]
U5  LTC6992  [LTC6992]
U6  4ch DAC  [MAX5715]

### Ports
LF_PWM0 (in), LF_PWM1 (in), LF_PWM2 (in), LF_PWM3 (in), PI_MOSI (in), PI_SCK (in), PI_SCL (in), PI_SDA (bidir), PI_SS_DA (in), PWM_OE (in), SIG_DRL (out), SIG_RAIL (out), SIG_SPR (out), SIG_TTB (out)

### Nets
+3.3: C1.2 NT2.2(Net2) R1.1 U1.3(A2) U1.5(A4) U1.24(A5) U1.28(VDD)
+5: R2.1(R1A) R2.2(R2A) R2.3(R3A) R2.4(R4A) R3.1(R1A) R3.2(R2A) R3.3(R3A) R3.4(R4A) R4.1(R1A) R4.2(R2A) R4.3(R3A) R4.4(R4A)
+A3.3: C2.2 C3.2 C4.2 C5.2 C6.2 NT2.1(Net1) R9.1 R10.2 U2.5(VDD) U3.5(VDD) U4.5(VDD) U5.5(VDD) U6.7(VDD) U6.13(VDDIO)
AGND: C2.1 C3.1 C4.1 C5.1 C6.1 NT1.1(Net1) R5.2 R6.2 R7.2 R8.2 R11.2 R13.1(R1A) R13.2(R2A) R13.3(R3A) R13.4(R4A) U2.2(GND) U3.2(GND) U4.2(GND) U5.2(GND) U6.4(GND)
GND: C1.1 NT1.2(Net2) U1.1(A0) U1.2(A1) U1.4(A3) U1.14(VSS) U1.25(EXTCLK)
LF_PWM04: D1.3(RC) U1.10(LED4)
LF_PWM05: D1.2(GC) U1.11(LED5)
LF_PWM06: D1.1(BC) U1.12(LED6)
LF_PWM07: D2.3(RC) U1.13(LED7)
LF_PWM08: D2.2(GC) U1.15(LED8)
LF_PWM09: D2.1(BC) U1.16(LED9)
LF_PWM10: D3.3(RC) U1.17(LED10)
LF_PWM11: D3.2(GC) U1.18(LED11)
LF_PWM12: D3.1(BC) U1.19(LED12)
LF_PWM13: D4.3(RC) U1.20(LED13)
LF_PWM14: D4.2(GC) U1.21(LED14)
LF_PWM15: D4.1(BC) U1.22(LED15)
MOTOR_ANALOGUE_0: R12.1(R1A) R13.8(R1B) U2.1(MOD)
MOTOR_ANALOGUE_1: R12.2(R2A) R13.7(R2B) U3.1(MOD)
MOTOR_ANALOGUE_2: R12.3(R3A) R13.6(R3B) U4.1(MOD)
MOTOR_ANALOGUE_3: R12.4(R4A) R13.5(R4B) U5.1(MOD)
PI_MOSI: U6.9(DIN) ; port PI_MOSI
PI_SCK: U6.10(SCLK) ; port PI_SCK
PI_SCL: U1.26(SCL) ; port PI_SCL
PI_SDA: U1.27(SDA) ; port PI_SDA
NetD1_4: D1.4(RA) R2.5(R4B)
NetD1_5: D1.5(GA) R3.5(R4B)
NetD1_6: D1.6(BA) R4.8(R1B)
NetD2_4: D2.4(RA) R2.6(R3B)
NetD2_5: D2.5(GA) R3.6(R3B)
NetD2_6: D2.6(BA) R4.7(R2B)
NetD3_4: D3.4(RA) R2.7(R2B)
NetD3_5: D3.5(GA) R3.7(R2B)
NetD3_6: D3.6(BA) R4.6(R3B)
NetD4_4: D4.4(RA) R2.8(R1B)
NetD4_5: D4.5(GA) R3.8(R1B)
NetD4_6: D4.6(BA) R4.5(R4B)
NetR1_2: R1.2 U1.23(~{OE}) ; port PWM_OE
NetR5_1: R5.1 U2.3(SET)
NetR6_1: R6.1 U3.3(SET)
NetR7_1: R7.1 U4.3(SET)
NetR8_1: R8.1 U5.3(SET)
NetR9_2: R9.2 R11.1 U2.4(DIV) U3.4(DIV) U4.4(DIV) U5.4(DIV)
NetR10_1: R10.1 U6.12(CLR) U6.14(LDAC)
NetR12_5: R12.5(R4B) U6.6(OUTD)
NetR12_6: R12.6(R3B) U6.5(OUTC)
NetR12_7: R12.7(R2B) U6.3(OUTB)
NetR12_8: R12.8(R1B) U6.2(OUTA)
NetU1_6: U1.6(LED0) ; port LF_PWM0
NetU1_7: U1.7(LED1) ; port LF_PWM1
NetU1_8: U1.8(LED2) ; port LF_PWM2
NetU1_9: U1.9(LED3) ; port LF_PWM3
NetU2_6: U2.6(OUT) ; port SIG_DRL
NetU3_6: U3.6(OUT) ; port SIG_RAIL
NetU4_6: U4.6(OUT) ; port SIG_TTB
NetU5_6: U5.6(OUT) ; port SIG_SPR
NetU6_11: U6.11(CSB) ; port PI_SS_DA

Not connected (* = marked no-connect by the designer): U6 1(REF)* 8(RDY)*

### Notes on the sheet
- TO-DO LIST
- (near U1) Sets 0x74

### Library data of the parts
C1-C6 = Cap: Capacitor; Published: 8-Jun-2000; LatestRevisionDate: 17-Jul-2002; LatestRevisionNote: Re-released for DXP Platform.; PackageReference: RAD-0.3; Publisher: Altium Limited; PackageDescription: Radial Cap, Thru-Hole; 2 Leads; 0.3 in Pin Spacing
D1-D4 = RGB_LED: RGB LED
NT1 NT2 = CMP-0488-00002-2: Net-Tie, Surface Mount, 2.0 mm x 0.8 mm, 2 Pads (1.2 mm x 0.8 mm); Manufacturer: No Vendor; PartNumber: NETTIE-SMT2-W0.8L2.0(MM)
R1 R5-R11 = Res3: Resistor; Published: 8-Jun-2000; LatestRevisionDate: 29-May-2009; LatestRevisionNote: IPC-7351 Footprint Added.; PackageReference: J1-0603; Publisher: Altium Limited; PackageDescription: Chip Resistor
R2 = RESNET_4: 4-Resistor Network; Value: 150
R3 R4 = RESNET_4: 4-Resistor Network; Value: 100
R12 = RESNET_4: 4-Resistor Network; Value: 15K
R13 = RESNET_4: 4-Resistor Network; Value: 10K
U1 = CMP-1595-00003-2: 16-Channel, 12-Bit PWM Fm+ I2C-Bus LED Controller, 2.3 to 5.5 V, -40 to 85 degC, 28-Pin TSSOP (SOT361-1), RoHS, Tape and Reel; Supply Current Max: 10 mA; Supply Voltage Min: 2.3 V; Supply Voltage Max: 5.5 V; Frequency: 25000000 Hz; Temperature Max: 85 degC; ComponentLink1URL: http://www.nxp.com/; ComponentLink3Description: Package Specification; PackageVersion: 02/2003; ComponentLink2Description: Datasheet; Code_JEDEC: MO-153; RoHS: TRUE; Mounting Technology: Surface Mount; PackageDescription: 28-Pin Small Outline Package, Body 9.7 x 4.4 mm, Pitch 0.65 mm; ComponentLink2URL: http://www.nxp.com/documents/data_sheet/PCA9685.pdf; Packing: Tape and Reel; ComponentLink1Description: Manufacturer URL; PartNumber: PCA9685; ComponentLink3URL: http://www.nxp.com/documents/outline_drawing/sot361-1_po.pdf; DatasheetVersion: Rev. 4; Temperature Min: -40 degC
U2-U5 = LTC6992: Voltage-Controlled Pulse / Width Modulator (PWM)
U6 = MAX5715: Ultra-Small, Quad-Channel, 8-/10-/12-Bit Buffered / Output DACs with Internal Reference and SPI Interface

## Nets that join several sheets
+3.3: Science (5 pins), Power (12 pins), SensorExt (U19.5 U19.10 U19.12 U19.13), SensorInt (11 pins), Motors (R18.2), Drivers (7 pins)
+3.3SENS: Science (P11.4 P12.5), Power (F2.2), SensorExt (5 pins), SensorInt (12 pins)
+5: Science (P13.2 P13.4 R32.2), Power (J1.5), SensorExt (P25.1), Motors (12 pins), Drivers (12 pins)
+24: Science (R31.2), Power (F1.1 J1.2)
GND: Science (14 pins), Power (16 pins), SensorExt (10 pins), SensorInt (19 pins), Motors (25 pins), Drivers (7 pins)
FAULT: Science (P13.7), Motors (5 pins)
NetR1_2: Science (U18.17), Drivers (R1.2 U1.23)
NetR24_1: Power (R24.1 U13.8 U13.9), Motors (U7.16)
NetR25_1: Power (R25.1 U14.8 U14.9), Motors (U8.16)
NetR26_1: Power (R26.1 U15.8 U15.9), Motors (U9.16)
NetR27_1: Power (R27.1 U16.8 U16.9), Motors (U10.16)
NetU1_6: Motors (U11.2), Drivers (U1.6)
NetU1_7: Motors (U11.3), Drivers (U1.7)
NetU1_8: Motors (U12.2), Drivers (U1.8)
NetU1_9: Motors (U12.3), Drivers (U1.9)
NetU2_6: Motors (U7.3), Drivers (U2.6)
NetU3_6: Motors (U8.3), Drivers (U3.6)
NetU4_6: Motors (U9.3), Drivers (U4.6)
NetU5_6: Motors (U10.3), Drivers (U5.6)
NetU6_11: Science (U18.8), Drivers (U6.11)
NetU7_2: Science (U18.13), Motors (U7.2)
NetU8_2: Science (U18.14), Motors (U8.2)
NetU9_2: Science (U18.15), Motors (U9.2)
NetU10_2: Science (U18.16), Motors (U10.2)
NetU18_4: Science (U18.4), SensorInt (U22.4)
NetU18_5: Science (U18.5), SensorInt (U23.4)
NetU18_6: Science (U18.6), SensorInt (U24.4)
NetU18_7: Science (U18.7), SensorExt (U19.16)
PI_LIM1: Science (P13.12), SensorInt (U20.2)
PI_LIM2: Science (P13.16), SensorInt (U20.4)
PI_LIM3: Science (P13.18), SensorInt (U20.6)
PI_MISO: Science (P12.3 P13.21), SensorExt (U19.1), SensorInt (U22.6 U23.6 U24.6)
PI_MOSI: Science (P12.4 P13.19), SensorExt (U19.2), SensorInt (U22.7 U23.7 U24.7), Drivers (U6.9)
PI_SCK: Science (P12.2 P13.23), SensorExt (U19.3), SensorInt (U22.5 U23.5 U24.5), Drivers (U6.10)
PI_SCL: Science (P11.3 P13.5 U18.22), Power (7 pins), SensorExt (5 pins), Drivers (U1.26)
PI_SDA: Science (6 pins), Power (10 pins), SensorExt (5 pins), Drivers (U1.27)
SLEEP: Science (P13.33), Motors (5 pins)